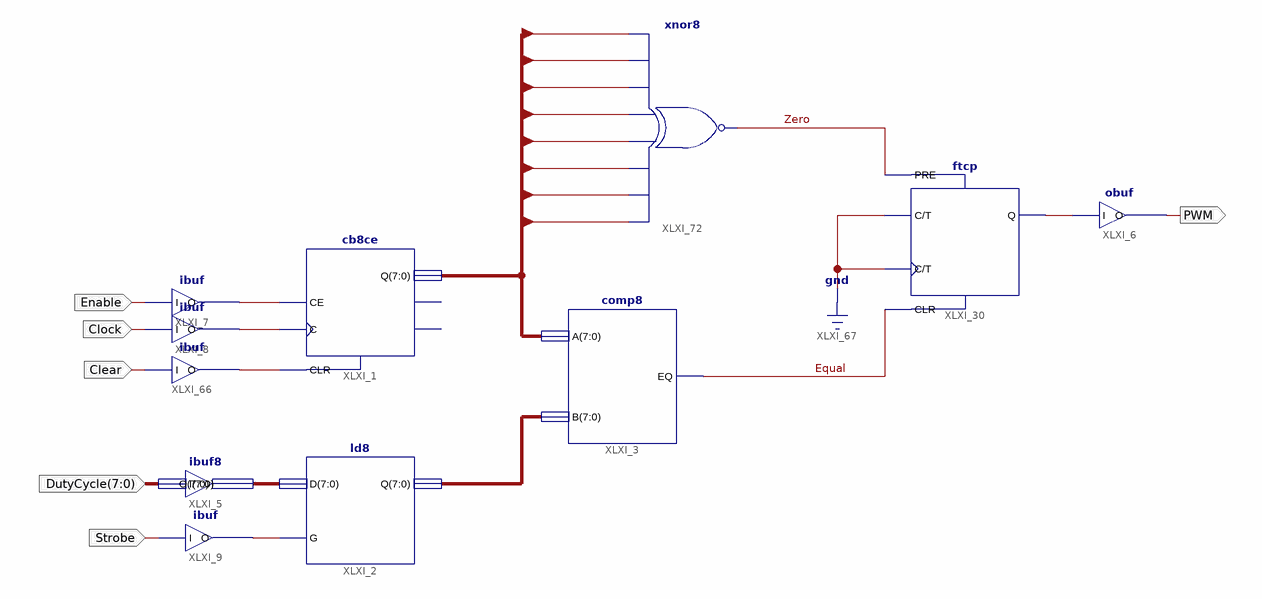
[diagram p0: schematic sheet 1]
// Xilinx ISE schematic PWM_Generator.sch (xc9500xl) as structural Verilog: 11 symbols, 6 ports
module PWM_Generator (
  input  [7:0] DutyCycle,
  input  Strobe,
  input  Clock,
  input  Enable,
  input  Clear,
  output PWM
);

  wire Equal, XLXN_4, XLXN_5, XLXN_7, XLXN_25, XLXN_139, Zero;
  wire [7:0] XLXN_6, XLXN_120, XLXN_121;

  comp8 XLXI_3 (.A(XLXN_120), .B(XLXN_121), .EQ(Equal));
  ftcp XLXI_30 (.C(1'b0), .CLR(Equal), .PRE(Zero), .T(1'b0), .Q(XLXN_25));
  obuf XLXI_6 (.I(XLXN_25), .O(PWM));
  ibuf8 XLXI_5 (.I(DutyCycle), .O(XLXN_6));
  ibuf XLXI_9 (.I(Strobe), .O(XLXN_7));
  ld8 XLXI_2 (.D(XLXN_6), .G(XLXN_7), .Q(XLXN_121));
  ibuf XLXI_7 (.I(Enable), .O(XLXN_4));
  ibuf XLXI_8 (.I(Clock), .O(XLXN_5));
  ibuf XLXI_66 (.I(Clear), .O(XLXN_139));
  cb8ce XLXI_1 (.C(XLXN_5), .CE(XLXN_4), .CLR(XLXN_139), .Q(XLXN_120));  // open: CEO, TC
  xnor XLXI_72 (Zero, XLXN_120[0], XLXN_120[1], XLXN_120[2], XLXN_120[3], XLXN_120[4], XLXN_120[5], XLXN_120[6], XLXN_120[7]);
endmodule
